# EAGLE schematic CubeSatStack_Temp (EAGLE 7.7.0)
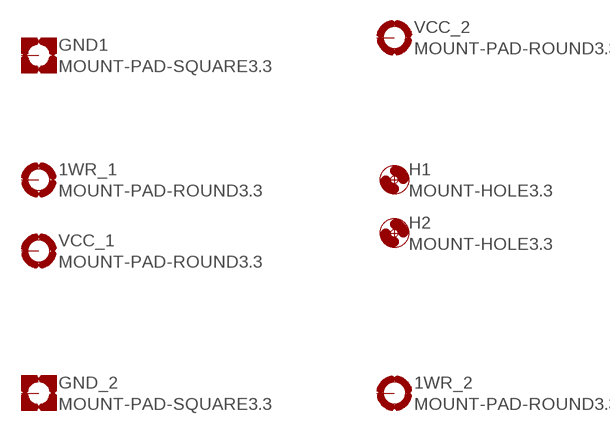
[diagram p0: schematic, sheet 1]

## Parts
1WR_1  MOUNT-PAD-ROUND3.3  [3,3-PAD]
1WR_2  MOUNT-PAD-ROUND3.3  [3,3-PAD]
GND1  MOUNT-PAD-SQUARE3.3  [3,3-PAD-SQUARE]
GND_2  MOUNT-PAD-SQUARE3.3  [3,3-PAD-SQUARE]
H1  MOUNT-HOLE3.3  [3,3]
H2  MOUNT-HOLE3.3  [3,3]
VCC_1  MOUNT-PAD-ROUND3.3  [3,3-PAD]
VCC_2  MOUNT-PAD-ROUND3.3  [3,3-PAD]
Unconnected: 1WR_1.B3,3(MOUNT) 1WR_2.B3,3(MOUNT) GND1.B3,3(MOUNT) GND_2.B3,3(MOUNT) VCC_1.B3,3(MOUNT) VCC_2.B3,3(MOUNT)

## Library data of the parts
1WR_1 1WR_2 VCC_1 VCC_2 = holes:MOUNT-PAD-ROUND: MOUNTING PAD, round
GND1 GND_2 = holes:MOUNT-PAD-SQUARE: MOUNTING PAD, square
H1 H2 = holes:MOUNT-HOLE: MOUNTING HOLE with drill center marker